# Altium project pca10028.PrjPCB (part 2 of 2)

## Sheet pca10028_power_supply.SchDoc: PCA10028 - Power Supply
size A4; Revision: 1.0.0; SheetNumber: 5; SheetTotal: 5; DrawnBy: RUBR; ProjectNumber: 4403; PCBRevision: 0169RUBR; DocumentSize: A4; PCAName: PCA10028; PCBNumber: 400092; ProjectName: Cost optimized nRF51-EK
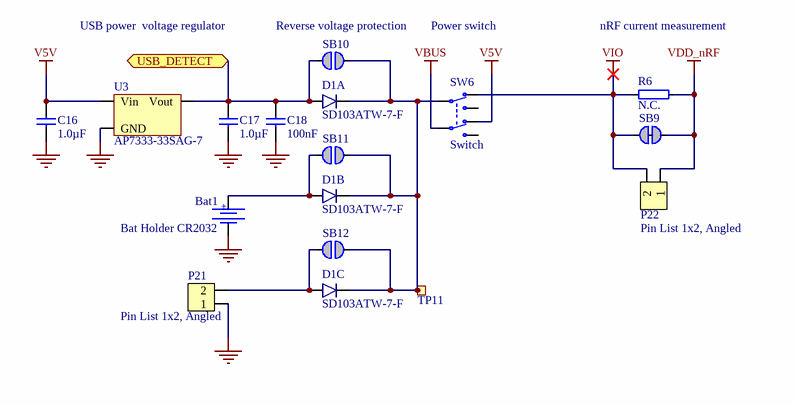
[diagram p4: pca10028_power_supply.SchDoc]

### Parts
Bat1  Bat Holder CR2032  [CR2032_HOLDER_SMD]
C16  1.0µF  [CAPC1608X06L]
C17  1.0µF  [CAPC1608X06L]
C18  100nF  [CAPC1005X04L]
D1  SD103ATW-7-F  [SOT-363]  (parts A,B,C of 3)
P21  Pin List 1x2, Angled  [LIST_ANG_1x2-SMD-2.54MM]
P22  Pin List 1x2, Angled  [LIST_ANG_1x2-SMD-2.54MM]
R6  N.C.  [RESC1005X04L]
SB9  Solderbridge  [Solderbridge_Shorted]  (value not drawn)  (net tie, no BOM)
SB10  Solderbridge  [Solderbridge]  (value not drawn)  (no BOM)
SB11  Solderbridge  [Solderbridge]  (value not drawn)  (no BOM)
SB12  Solderbridge  [Solderbridge]  (value not drawn)  (no BOM)
SW6  Switch  [JS202011SCQN]
TP11  Ø1.0mm,SMD  [TP_SMD_Ø1.0mm]  (value not drawn)  (no BOM)
U3  AP7333-33SAG-7  [SOT-23A]

### Ports
USB_DETECT (bidir)

### Nets
GND: Bat1.2 C16.1 C17.1 C18.1 P21.1 U3.3(GND)
V5V: C16.2 SW6.6(N.C-2) U3.1(Vin)
VBUS: SW6.5(COM-2)
VDD_nRF: P22.1 R6.2 SB9.1
VIO: P22.2 R6.1 SB9.2 SW6.3(N.C-1)
NetBat1_1: Bat1.1 D1.5(A2) SB11.2
NetC17_2: C17.2 C18.2 D1.6(A1) SB10.2 U3.2(Vout) ; port USB_DETECT
NetD1_1: D1.1(C1) D1.2(C2) D1.3(C3) SB10.1 SB11.1 SB12.1 SW6.2(COM-1) TP11.1
NetD1_4: D1.4(A3) P21.2 SB12.2

Not connected (* = marked no-connect by the designer): SW6 1(N.O-1) 4(N.O-2)

### Notes on the sheet
- USB power  voltage regulator
- (near SB10) Reverse voltage protection
- Power switch
- nRF current measurement
- Title
- Size
- Date:
- Project Number
- Sheet         of
- Revision
- File:
- Drawn By:
- (in symbol Bat Holder CR2032 SMD) +

### Library data of the parts
Bat1 = Bat Holder CR2032 SMD: Manufacturer: Keystone; Manufacturer Part Number: 3002; 2nd source part number: 69-525-27; Artikkelnr Noca: 34019038; Artikkelnr Simpro: N.A.; Part Number: Bat Holder CR2032 SMD; Datasheet: http://www.farnell.com/datasheets/45480.pdf; LatestRevisionDate: 2011-05-11; Pin Count: 3; Publisher: Nordic Semiconductor; Published: 2009-12-12; Value: Bat Holder CR2032; Note: Bat Holder CR2032; Supplier: Farnell; Supplier part number: 165-0693; 2nd source Supplier: Elfa; Footprint Doc: CR2032_HOLDER_SMD
C16 C17 = C0603-1µ0: Capacitor, X7R, ±10%; Note: 16V; Artikkelnr Noca: 20039335; Artikkelnr Simpro: N.A.; Published: 2009-05-08; LatestRevisionDate: 2013-06-05; Publisher: Nordic Semiconductor; Value: 1.0µF; Part Number: C0603-1µ0; Manufacturer: *; Manufacturer Part Number: *; Datasheet: *; Pin Count: 2; Supplier: *; Supplier part number: *; 2nd source Supplier: *; 2nd source part number: *; Footprint Doc: 0603
C18 = C0402-100n: Capacitor, X7R, ±10%; Note: 16V; Artikkelnr Noca: 20039200; Artikkelnr Simpro: N.A.; Published: 2009-05-08; LatestRevisionDate: 2009-11-23; Publisher: Nordic Semiconductor; Value: 100nF; Part Number: C0402-100n; Manufacturer: *; Manufacturer Part Number: *; Datasheet: *; Pin Count: 2; Supplier: *; Supplier part number: *; 2nd source Supplier: *; 2nd source part number: *; Footprint Doc: 0402
D1 = SD103ATW-7-F: Surface Mount Schottky Barrier Diode Array; Manufacturer: Diodes Incorporated; 2nd source part number: 177-3507; Artikkelnr Noca: 10029109; Artikkelnr Simpro: N.A.; Part Number: SD103ATW-7-F; Manufacturer Part Number: SD103ATW-7-F; Datasheet: http://www.diodes.com/datasheets/ds30374.pdf; LatestRevisionDate: 2012-06-15; Publisher: Nordic Semiconductor; Published: 2012-06-15; Value: SD103ATW-7-F; Note: *; Supplier: Digi-Key; Supplier part number: SD103ATW-FDITR-ND; 2nd source Supplier: Farnell; Footprint Doc: SOT-363
P21 P22 = Pin List Ang 1x2 SMD, 2.54mm: Pin List 1x2, 2.54mm (100mil), Right Angled, SMD; 2nd source part number: S1113E-02-ND; Artikkelnr Noca: 55019265; Artikkelnr Simpro: N.A.; Part Number: Pin List Ang 1x2 SMD, 2.54mm; Manufacturer: *; Manufacturer Part Number: *; Datasheet: *; LatestRevisionDate: 2014-09-17; Pin Count: 2; Publisher: Nordic Semiconductor; Published: 2014-04-30; Value: Pin List 1x2, Angled; Note: *; Supplier: Samtec; Supplier part number: TSM-102-01-L-SH-A; 2nd source Supplier: Digi-Key; Footprint Doc: LIST_ANG_1x2-SMD-2.54MM
R6 = R0402-N.C.: Not mounted; Note: Chip Res; Artikkelnr Noca: N.A.; Part Number: R0402-N.C.; Manufacturer: *; Manufacturer Part Number: *; Datasheet: *; LatestRevisionDate: 2009-05-08; Pin Count: 2; Publisher: Nordic Semiconductor; Published: 2009-05-08; Value: N.C.; Supplier: *; Supplier part number: *; 2nd source Supplier: *; 2nd source part number: *; Footprint Doc: 0402; Artikkelnr Simpro: N.A.
SB9 = Solderbridge Shorted: Shorted Solderbridge; Artikkelnr Noca: N.A.; Part Number: Solderbridge Shorted; Manufacturer: *; Manufacturer Part Number: *; Datasheet: *; LatestRevisionDate: 2012-08-07; Pin Count: 2; Publisher: Nordic Semiconductor; Published: 2012-08-07; Value: Solderbridge; Note: *; Supplier: *; Supplier part number: *; 2nd source Supplier: *; 2nd source part number: *; Footprint Doc: Solderbridge_Shorted; Artikkelnr Simpro: N.A.
SB10-SB12 = Solderbridge: Artikkelnr Noca: N.A.; Part Number: Solderbridge; Manufacturer: *; Manufacturer Part Number: *; Datasheet: *; LatestRevisionDate: 2009-12-14; Pin Count: 2; Publisher: Nordic Semiconductor; Published: 2009-12-14; Value: Solderbridge; Note: *; Supplier: *; Supplier part number: *; 2nd source Supplier: *; 2nd source part number: *; Footprint Doc: Solderbridge; Artikkelnr Simpro: N.A.
SW6 = JS202011SCQN: SMD slide Switch (ON-ON); Manufacturer: C&K Components; 2nd source part number: 232-0019; Artikkelnr Noca: 50019088; Artikkelnr Simpro: N.A.; Part Number: JS202011SCQN; Manufacturer Part Number: JS202011SCQN; Datasheet: http://www.ck-components.com/14398/js_14july11.pdf/; LatestRevisionDate: 2014-09-17; Pin Count: 6; Publisher: Nordic Semiconductor; Published: 2014-06-24; Value: Switch; Note: *; Supplier: Digi-Key; Supplier part number: 401-2002-1-ND; 2nd source Supplier: Farnell; Footprint Doc: JS202011SCQN
TP11 = TP_SMD_Ø1.0MM: 1.0mm circular SMD testpad; Manufacturer: Nordic Semiconductor; Artikkelnr Noca: N.A.; Part Number: TP_SMD_Ø1.0MM; Manufacturer Part Number: *; Datasheet: *; LatestRevisionDate: 2013-06-11; Pin Count: 1; Publisher: Nordic Semiconductor; Published: 2013-06-11; Value: Ø1.0mm,SMD; Note: *; Supplier: *; Supplier part number: *; 2nd source Supplier: *; 2nd source part number: *; Footprint Doc: TP_SMD_Ø1.0mm; Artikkelnr Simpro: N.A.
U3 = AP7333-33SAG-7: 300mA, Low Quiescent Current, Fast Transient Low Dropout Linear Regulator; Manufacturer: Diodes Incorporated; Artikkelnr Noca: 17039216; Artikkelnr Simpro: N.A.; Part Number: AP7333-33SAG-7; Manufacturer Part Number: AP7333-33SAG-7; Datasheet: http://www.diodes.com/datasheets/AP7333.pdf; LatestRevisionDate: 2012-06-15; Pin Count: 3; Publisher: Nordic Semiconductor; Published: 2012-06-15; Value: AP7333-33SAG-7; Note: *; Supplier: Digi-Key; Supplier part number: AP7333-33SAG-7DICT-ND; 2nd source Supplier: *; 2nd source part number: *; Footprint Doc: SOT-23-3

## Nets that join several sheets
GND: pca10028_radio (21 pins), pca10028_interface_mcu (47 pins), pca10028_buttons_and_leds (5 pins), pca10028_connectors (58 pins), pca10028_power_supply (6 pins)
V5V: pca10028_interface_mcu (J3.5), pca10028_connectors (5 pins), pca10028_power_supply (C16.2 SW6.6 U3.1)
VBUS: pca10028_interface_mcu (5 pins), pca10028_power_supply (SW6.5)
VDD_nRF: pca10028_radio (C7.1 C11.1 U1.1 U1.12), pca10028_connectors (P20.1), pca10028_power_supply (P22.1 R6.2 SB9.1)
VIO: pca10028_interface_mcu (27 pins), pca10028_buttons_and_leds (5 pins), pca10028_connectors (11 pins), pca10028_power_supply (P22.2 R6.1 SB9.2 SW6.3)
BOOT: pca10028_interface_mcu (U2.24), pca10028_buttons_and_leds (R5.1 SW5.1)
NetC17_2: pca10028_interface_mcu (Q1.2 Q2.2 R7.1 U2.90), pca10028_power_supply (5 pins)
NetP19_1: pca10028_interface_mcu (Q1.4 R8.1), pca10028_connectors (P19.1)
NetP19_2: pca10028_interface_mcu (U2.71), pca10028_connectors (P19.2)
NetP19_4: pca10028_interface_mcu (U2.70), pca10028_connectors (P19.4)
NetP19_6: pca10028_interface_mcu (U2.69), pca10028_connectors (P19.6)
NetP19_9: pca10028_interface_mcu (U2.67), pca10028_connectors (P19.9)
NetP19_10: pca10028_interface_mcu (U2.68), pca10028_connectors (P19.10)
NetP20_3: pca10028_interface_mcu (Q2.4 R9.1), pca10028_connectors (P20.3)
NetP20_4: pca10028_interface_mcu (U2.66), pca10028_connectors (P20.4)
NetP20_5: pca10028_interface_mcu (U2.65), pca10028_connectors (P20.5)
NetP20_6: pca10028_interface_mcu (U2.64), pca10028_connectors (P20.6)
NetP20_7: pca10028_interface_mcu (U2.63), pca10028_connectors (P20.7)
NetP20_8: pca10028_interface_mcu (U2.62), pca10028_connectors (P20.8)
P0.00: pca10028_radio (U1.4), pca10028_connectors (P4.8 P10.8 P16.16)
P0.01: pca10028_radio (U1.5), pca10028_connectors (P2.1 P8.1 P14.2)
P0.02: pca10028_radio (U1.6), pca10028_connectors (P2.2 P8.2 P14.4)
P0.03: pca10028_radio (U1.7), pca10028_connectors (P2.3 P8.3 P14.6)
P0.04: pca10028_radio (U1.8), pca10028_connectors (P2.4 P8.4 P14.8)
P0.05: pca10028_radio (U1.9), pca10028_connectors (P2.5 P8.5 P14.10)
P0.06: pca10028_radio (U1.10), pca10028_connectors (P2.6 P8.6 P14.12)
P0.07: pca10028_radio (U1.11), pca10028_connectors (P4.10 P10.10 P16.20)
P0.08: pca10028_radio (U1.14), pca10028_interface_mcu (TP5.1 U2.38), pca10028_connectors (SB13.2)
P0.09: pca10028_radio (U1.15), pca10028_interface_mcu (TP6.1 U2.40), pca10028_connectors (SB14.2)
P0.10: pca10028_radio (U1.16), pca10028_interface_mcu (TP7.1 U2.39), pca10028_connectors (SB15.2)
P0.11: pca10028_radio (U1.17), pca10028_interface_mcu (TP8.1 U2.41), pca10028_connectors (SB16.2)
P0.12: pca10028_radio (U1.18), pca10028_connectors (P3.1 P9.1 P15.2)
P0.13: pca10028_radio (U1.19), pca10028_connectors (P3.2 P9.2 P15.4)
P0.14: pca10028_radio (U1.20), pca10028_connectors (P3.3 P9.3 P15.6)
P0.15: pca10028_radio (U1.21), pca10028_connectors (P3.4 P9.4 P15.8)
P0.16: pca10028_radio (U1.22), pca10028_connectors (P3.5 P9.5 P15.10)
P0.17: pca10028_radio (U1.25), pca10028_buttons_and_leds (SW1.1), pca10028_connectors (P3.6 P9.6 P15.12)
P0.18: pca10028_radio (U1.26), pca10028_buttons_and_leds (SW2.1), pca10028_connectors (P3.7 P9.7 P15.14)
P0.19: pca10028_radio (U1.27), pca10028_buttons_and_leds (SW3.1), pca10028_connectors (P3.8 P9.8 P15.16)
P0.20: pca10028_radio (U1.28), pca10028_buttons_and_leds (SW4.1), pca10028_connectors (P4.1 P10.1 P16.2)
P0.21: pca10028_radio (U1.40), pca10028_buttons_and_leds (SB5.1), pca10028_connectors (P6.1 P12.1 P17.2)
P0.22: pca10028_radio (U1.41), pca10028_buttons_and_leds (SB6.1), pca10028_connectors (P6.2 P12.2 P17.4)
P0.23: pca10028_radio (U1.42), pca10028_buttons_and_leds (SB7.1), pca10028_connectors (P4.2 P10.2 P16.4)
P0.24: pca10028_radio (U1.43), pca10028_buttons_and_leds (SB8.1), pca10028_connectors (P4.3 P10.3 P16.6)
P0.25: pca10028_radio (U1.44), pca10028_connectors (5 pins)
P0.26: pca10028_radio (SB3.2), pca10028_connectors (P6.3 P12.3 P17.6)
P0.27: pca10028_radio (SB4.2), pca10028_connectors (P6.4 P12.4 P17.8)
P0.28: pca10028_radio (U1.47), pca10028_connectors (5 pins)
P0.29: pca10028_radio (U1.48), pca10028_connectors (5 pins)
P0.30: pca10028_radio (U1.3), pca10028_connectors (P4.9 P10.9 P16.18)
SWCLK: pca10028_radio (U1.24), pca10028_interface_mcu (R16.2 TP10.1 U2.5), pca10028_connectors (P18.4)
SWDIO: pca10028_radio (U1.23), pca10028_interface_mcu (R15.2 TP9.1 U2.12), pca10028_connectors (P18.2 SB17.2)